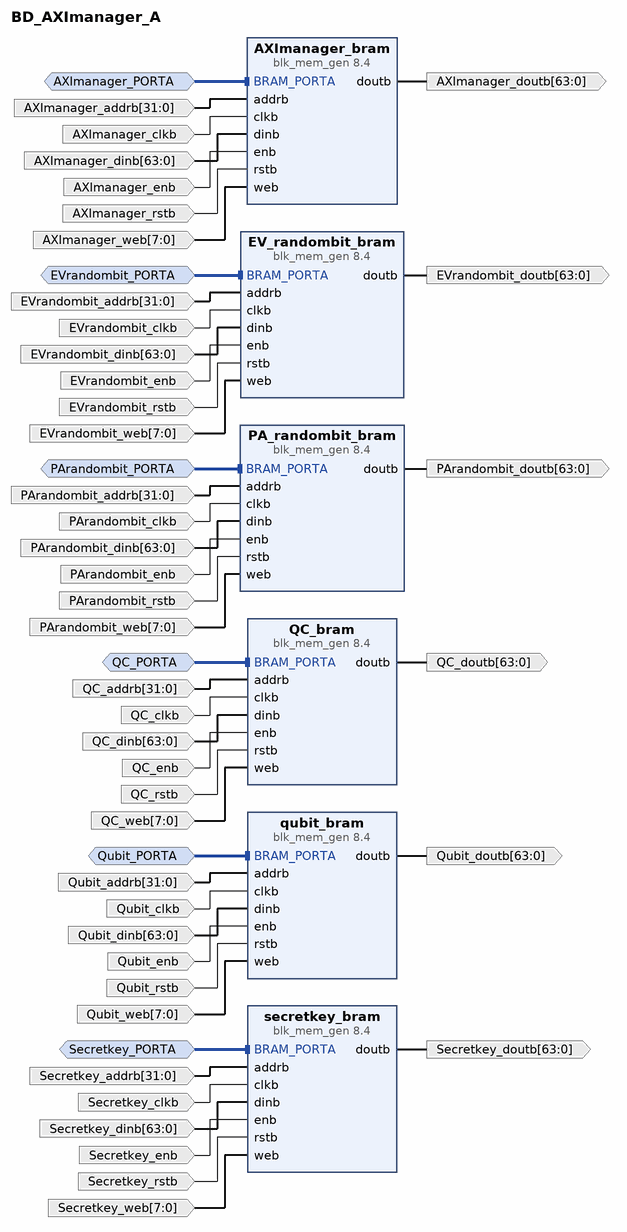
[diagram p0: block diagram of the top level]
# Vivado block design BD_AXImanager_A, xcku5p-ffvb676-2-e, Vivado 2022.1
create_bd_design BD_AXImanager_A

create_bd_intf_port -mode Slave -vlnv xilinx.com:interface:bram_rtl:1.0 AXImanager_PORTA
set_property -dict [list \
  CONFIG.MASTER_TYPE BRAM_CTRL \
  CONFIG.MEM_SIZE 4096 \
  CONFIG.MEM_WIDTH 64 \
  CONFIG.READ_WRITE_MODE READ_WRITE \
] [get_bd_intf_ports AXImanager_PORTA]
create_bd_intf_port -mode Slave -vlnv xilinx.com:interface:bram_rtl:1.0 EVrandombit_PORTA
set_property -dict [list \
  CONFIG.MASTER_TYPE BRAM_CTRL \
  CONFIG.MEM_SIZE 131072 \
  CONFIG.MEM_WIDTH 64 \
  CONFIG.READ_WRITE_MODE READ_WRITE \
] [get_bd_intf_ports EVrandombit_PORTA]
create_bd_intf_port -mode Slave -vlnv xilinx.com:interface:bram_rtl:1.0 PArandombit_PORTA
set_property -dict [list \
  CONFIG.MASTER_TYPE BRAM_CTRL \
  CONFIG.MEM_SIZE 131072 \
  CONFIG.MEM_WIDTH 64 \
  CONFIG.READ_WRITE_MODE READ_WRITE \
] [get_bd_intf_ports PArandombit_PORTA]
create_bd_intf_port -mode Slave -vlnv xilinx.com:interface:bram_rtl:1.0 QC_PORTA
set_property -dict [list \
  CONFIG.MASTER_TYPE BRAM_CTRL \
  CONFIG.MEM_SIZE 262144 \
  CONFIG.MEM_WIDTH 64 \
  CONFIG.READ_WRITE_MODE READ_WRITE \
] [get_bd_intf_ports QC_PORTA]
create_bd_intf_port -mode Slave -vlnv xilinx.com:interface:bram_rtl:1.0 Qubit_PORTA
set_property -dict [list \
  CONFIG.MASTER_TYPE BRAM_CTRL \
  CONFIG.MEM_SIZE 262144 \
  CONFIG.MEM_WIDTH 64 \
  CONFIG.READ_WRITE_MODE READ_WRITE \
] [get_bd_intf_ports Qubit_PORTA]
create_bd_intf_port -mode Slave -vlnv xilinx.com:interface:bram_rtl:1.0 Secretkey_PORTA
set_property -dict [list \
  CONFIG.MASTER_TYPE BRAM_CTRL \
  CONFIG.MEM_SIZE 262144 \
  CONFIG.MEM_WIDTH 64 \
  CONFIG.READ_WRITE_MODE READ_WRITE \
] [get_bd_intf_ports Secretkey_PORTA]
create_bd_port -dir I -from 31 -to 0 AXImanager_addrb
create_bd_port -dir I -type clk AXImanager_clkb
create_bd_port -dir I -from 63 -to 0 AXImanager_dinb
create_bd_port -dir O -from 63 -to 0 AXImanager_doutb
create_bd_port -dir I AXImanager_enb
create_bd_port -dir I -from 7 -to 0 AXImanager_web
create_bd_port -dir I -type rst PArandombit_rstb
create_bd_port -dir O -from 63 -to 0 PArandombit_doutb
create_bd_port -dir I PArandombit_enb
create_bd_port -dir I -type clk PArandombit_clkb
create_bd_port -dir I -from 63 -to 0 PArandombit_dinb
create_bd_port -dir I -from 31 -to 0 PArandombit_addrb
create_bd_port -dir I -from 7 -to 0 PArandombit_web
create_bd_port -dir I -type rst EVrandombit_rstb
create_bd_port -dir O -from 63 -to 0 EVrandombit_doutb
create_bd_port -dir I EVrandombit_enb
create_bd_port -dir I -type clk EVrandombit_clkb
create_bd_port -dir I -from 63 -to 0 EVrandombit_dinb
create_bd_port -dir I -from 31 -to 0 EVrandombit_addrb
create_bd_port -dir I -from 7 -to 0 EVrandombit_web
create_bd_port -dir I -from 31 -to 0 Qubit_addrb
create_bd_port -dir I -type clk Qubit_clkb
create_bd_port -dir I -from 63 -to 0 Qubit_dinb
create_bd_port -dir O -from 63 -to 0 Qubit_doutb
create_bd_port -dir I Qubit_enb
create_bd_port -dir I -type rst Qubit_rstb
create_bd_port -dir I -from 7 -to 0 Qubit_web
create_bd_port -dir I -from 31 -to 0 Secretkey_addrb
create_bd_port -dir I -from 63 -to 0 Secretkey_dinb
create_bd_port -dir I -type clk Secretkey_clkb
create_bd_port -dir I Secretkey_enb
create_bd_port -dir O -from 63 -to 0 Secretkey_doutb
create_bd_port -dir I -type rst Secretkey_rstb
create_bd_port -dir I -from 7 -to 0 Secretkey_web
create_bd_port -dir I -from 31 -to 0 QC_addrb
create_bd_port -dir I -type clk QC_clkb
create_bd_port -dir I -from 63 -to 0 QC_dinb
create_bd_port -dir O -from 63 -to 0 QC_doutb
create_bd_port -dir I QC_enb
create_bd_port -dir I -type rst QC_rstb
create_bd_port -dir I -from 7 -to 0 QC_web
create_bd_port -dir I -type rst AXImanager_rstb

create_bd_cell -type ip -vlnv xilinx.com:ip:blk_mem_gen:8.4 qubit_bram
set_property -dict {CONFIG.Memory_Type True_Dual_Port_RAM} [get_bd_cells qubit_bram]
create_bd_cell -type ip -vlnv xilinx.com:ip:blk_mem_gen:8.4 EV_randombit_bram
set_property -dict {CONFIG.Memory_Type True_Dual_Port_RAM} [get_bd_cells EV_randombit_bram]
create_bd_cell -type ip -vlnv xilinx.com:ip:blk_mem_gen:8.4 PA_randombit_bram
set_property -dict {CONFIG.Memory_Type True_Dual_Port_RAM} [get_bd_cells PA_randombit_bram]
create_bd_cell -type ip -vlnv xilinx.com:ip:blk_mem_gen:8.4 secretkey_bram
set_property -dict {CONFIG.Memory_Type True_Dual_Port_RAM} [get_bd_cells secretkey_bram]
create_bd_cell -type ip -vlnv xilinx.com:ip:blk_mem_gen:8.4 AXImanager_bram
set_property -dict [list \
  CONFIG.EN_SAFETY_CKT true \
  CONFIG.Enable_32bit_Address true \
  CONFIG.Enable_B Use_ENB_Pin \
  CONFIG.Memory_Type True_Dual_Port_RAM \
  CONFIG.Port_B_Clock 100 \
  CONFIG.Port_B_Enable_Rate 100 \
  CONFIG.Port_B_Write_Rate 50 \
  CONFIG.Register_PortA_Output_of_Memory_Primitives false \
  CONFIG.Register_PortB_Output_of_Memory_Primitives false \
  CONFIG.Use_RSTA_Pin true \
  CONFIG.Use_RSTB_Pin true \
  CONFIG.use_bram_block BRAM_Controller \
] [get_bd_cells AXImanager_bram]
create_bd_cell -type ip -vlnv xilinx.com:ip:blk_mem_gen:8.4 QC_bram
set_property -dict [list \
  CONFIG.Enable_B Use_ENB_Pin \
  CONFIG.Memory_Type True_Dual_Port_RAM \
  CONFIG.Port_B_Clock 100 \
  CONFIG.Port_B_Enable_Rate 100 \
  CONFIG.Port_B_Write_Rate 50 \
  CONFIG.Use_RSTB_Pin true \
] [get_bd_cells QC_bram]

# ---- connections ----

connect_bd_intf_net -intf_net BRAM_PORTA_0_1 [get_bd_intf_ports AXImanager_PORTA] [get_bd_intf_pins AXImanager_bram/BRAM_PORTA]
connect_bd_intf_net -intf_net BRAM_PORTA_0_2 [get_bd_intf_ports EVrandombit_PORTA] [get_bd_intf_pins EV_randombit_bram/BRAM_PORTA]
connect_bd_intf_net -intf_net BRAM_PORTA_0_3 [get_bd_intf_ports PArandombit_PORTA] [get_bd_intf_pins PA_randombit_bram/BRAM_PORTA]
connect_bd_intf_net -intf_net BRAM_PORTA_0_4 [get_bd_intf_ports QC_PORTA] [get_bd_intf_pins QC_bram/BRAM_PORTA]
connect_bd_intf_net -intf_net BRAM_PORTA_0_5 [get_bd_intf_ports Qubit_PORTA] [get_bd_intf_pins qubit_bram/BRAM_PORTA]
connect_bd_intf_net -intf_net BRAM_PORTA_0_6 [get_bd_intf_ports Secretkey_PORTA] [get_bd_intf_pins secretkey_bram/BRAM_PORTA]
connect_bd_net [get_bd_pins AXImanager_bram/doutb] [get_bd_ports AXImanager_doutb]
connect_bd_net [get_bd_pins EV_randombit_bram/doutb] [get_bd_ports EVrandombit_doutb]
connect_bd_net [get_bd_pins PA_randombit_bram/doutb] [get_bd_ports PArandombit_doutb]
connect_bd_net [get_bd_pins QC_bram/doutb] [get_bd_ports QC_doutb]
connect_bd_net -net addrb_0_1 [get_bd_ports AXImanager_addrb] [get_bd_pins AXImanager_bram/addrb]
connect_bd_net -net addrb_0_2 [get_bd_ports PArandombit_addrb] [get_bd_pins PA_randombit_bram/addrb]
connect_bd_net -net addrb_0_3 [get_bd_ports EVrandombit_addrb] [get_bd_pins EV_randombit_bram/addrb]
connect_bd_net -net addrb_0_4 [get_bd_ports Qubit_addrb] [get_bd_pins qubit_bram/addrb]
connect_bd_net -net addrb_0_5 [get_bd_ports Secretkey_addrb] [get_bd_pins secretkey_bram/addrb]
connect_bd_net -net addrb_0_6 [get_bd_ports QC_addrb] [get_bd_pins QC_bram/addrb]
connect_bd_net -net clkb_0_1 [get_bd_ports AXImanager_clkb] [get_bd_pins AXImanager_bram/clkb]
connect_bd_net -net clkb_0_2 [get_bd_ports PArandombit_clkb] [get_bd_pins PA_randombit_bram/clkb]
connect_bd_net -net clkb_0_3 [get_bd_ports EVrandombit_clkb] [get_bd_pins EV_randombit_bram/clkb]
connect_bd_net -net clkb_0_4 [get_bd_ports Qubit_clkb] [get_bd_pins qubit_bram/clkb]
connect_bd_net -net clkb_0_5 [get_bd_ports Secretkey_clkb] [get_bd_pins secretkey_bram/clkb]
connect_bd_net -net clkb_0_6 [get_bd_ports QC_clkb] [get_bd_pins QC_bram/clkb]
connect_bd_net -net dinb_0_1 [get_bd_ports AXImanager_dinb] [get_bd_pins AXImanager_bram/dinb]
connect_bd_net -net dinb_0_2 [get_bd_ports PArandombit_dinb] [get_bd_pins PA_randombit_bram/dinb]
connect_bd_net -net dinb_0_3 [get_bd_ports EVrandombit_dinb] [get_bd_pins EV_randombit_bram/dinb]
connect_bd_net -net dinb_0_4 [get_bd_ports Qubit_dinb] [get_bd_pins qubit_bram/dinb]
connect_bd_net -net dinb_0_5 [get_bd_ports Secretkey_dinb] [get_bd_pins secretkey_bram/dinb]
connect_bd_net -net dinb_0_6 [get_bd_ports QC_dinb] [get_bd_pins QC_bram/dinb]
connect_bd_net -net enb_0_1 [get_bd_ports AXImanager_enb] [get_bd_pins AXImanager_bram/enb]
connect_bd_net -net enb_0_2 [get_bd_ports PArandombit_enb] [get_bd_pins PA_randombit_bram/enb]
connect_bd_net -net enb_0_3 [get_bd_ports EVrandombit_enb] [get_bd_pins EV_randombit_bram/enb]
connect_bd_net -net enb_0_4 [get_bd_ports Qubit_enb] [get_bd_pins qubit_bram/enb]
connect_bd_net -net enb_0_5 [get_bd_ports Secretkey_enb] [get_bd_pins secretkey_bram/enb]
connect_bd_net -net enb_0_6 [get_bd_ports QC_enb] [get_bd_pins QC_bram/enb]
connect_bd_net [get_bd_pins qubit_bram/doutb] [get_bd_ports Qubit_doutb]
connect_bd_net -net rstb_0_1 [get_bd_ports AXImanager_rstb] [get_bd_pins AXImanager_bram/rstb]
connect_bd_net -net rstb_0_2 [get_bd_ports PArandombit_rstb] [get_bd_pins PA_randombit_bram/rstb]
connect_bd_net -net rstb_0_3 [get_bd_ports EVrandombit_rstb] [get_bd_pins EV_randombit_bram/rstb]
connect_bd_net -net rstb_0_4 [get_bd_ports Qubit_rstb] [get_bd_pins qubit_bram/rstb]
connect_bd_net -net rstb_0_5 [get_bd_ports Secretkey_rstb] [get_bd_pins secretkey_bram/rstb]
connect_bd_net -net rstb_0_6 [get_bd_ports QC_rstb] [get_bd_pins QC_bram/rstb]
connect_bd_net [get_bd_pins secretkey_bram/doutb] [get_bd_ports Secretkey_doutb]
connect_bd_net -net web_0_1 [get_bd_ports AXImanager_web] [get_bd_pins AXImanager_bram/web]
connect_bd_net -net web_0_2 [get_bd_ports PArandombit_web] [get_bd_pins PA_randombit_bram/web]
connect_bd_net -net web_0_3 [get_bd_ports EVrandombit_web] [get_bd_pins EV_randombit_bram/web]
connect_bd_net -net web_0_4 [get_bd_ports Qubit_web] [get_bd_pins qubit_bram/web]
connect_bd_net -net web_0_5 [get_bd_ports Secretkey_web] [get_bd_pins secretkey_bram/web]
connect_bd_net -net web_0_6 [get_bd_ports QC_web] [get_bd_pins QC_bram/web]

validate_bd_design
save_bd_design
